# Altium schematic sheet miniPCIE_Connector.SchDoc: miniPCIE Connector
size B; DocumentNumber: 10; SheetNumber: 10; SheetTotal: 46
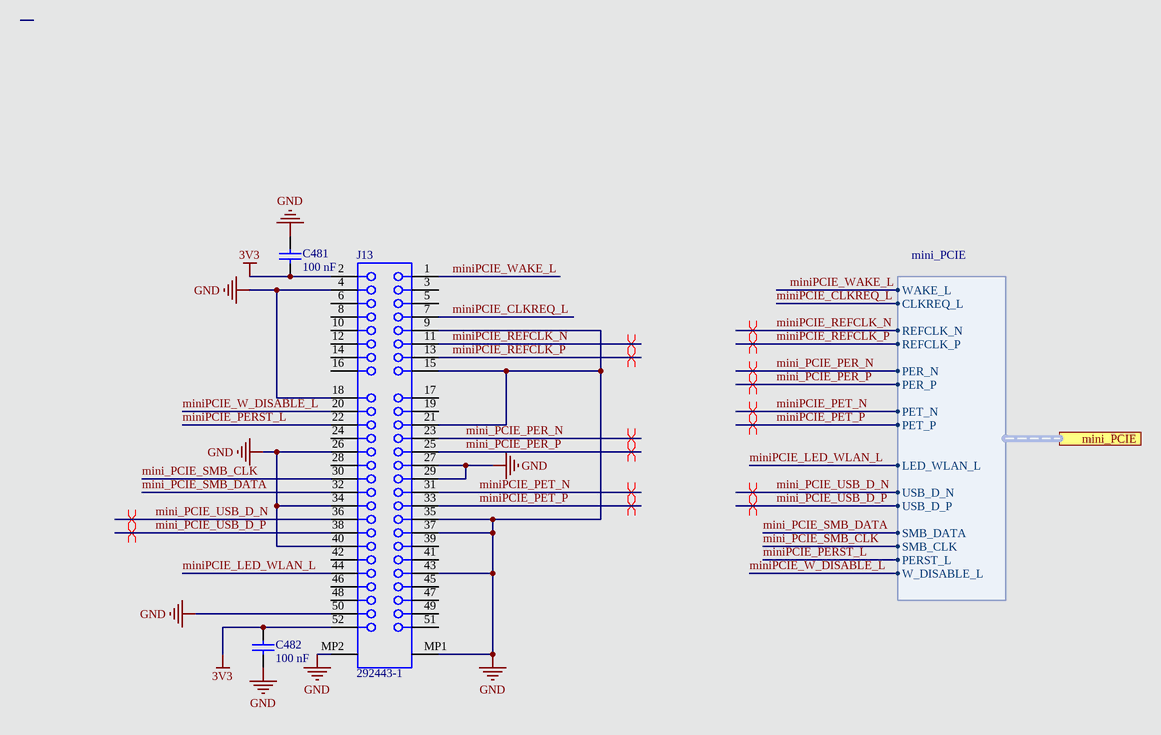
[diagram p0: miniPCIE_Connector.SchDoc]

## Parts
C481  Capacitance: 100 nF  [CAPC1005X55X10LL05]  (hidden comment: C1005X7R1E104M)
C482  Capacitance: 100 nF  [CAPC1005X55X10LL05]  (hidden comment: C1005X7R1E104M)
J13  292443-1  [BTB-SM0-8-2H52F]

## Ports
mini_PCIE (harness mini_PCIE)

## Harnesses
mini_PCIE: WAKE_L, CLKREQ_L, REFCLK_N, REFCLK_P, PER_N, PER_P, PET_N, PET_P, LED_WLAN_L, USB_D_N, USB_D_P, SMB_DATA, SMB_CLK, PERST_L, W_DISABLE_L

## Nets
3V3: C481.2 C482.1 J13.2 J13.52
GND: C481.1 C482.2 J13.4 J13.9 J13.15 J13.18 J13.21 J13.26 J13.27 J13.29 J13.34 J13.35 J13.37 J13.40 J13.43 J13.50 J13.MP1 J13.MP2
mini_PCIE_PER_N: J13.23 ; port mini_PCIE.PER_N
mini_PCIE_PER_P: J13.25 ; port mini_PCIE.PER_P
mini_PCIE_SMB_CLK: J13.30 ; port mini_PCIE.SMB_CLK
mini_PCIE_SMB_DATA: J13.32 ; port mini_PCIE.SMB_DATA
mini_PCIE_USB_D_N: J13.36 ; port mini_PCIE.USB_D_N
mini_PCIE_USB_D_P: J13.38 ; port mini_PCIE.USB_D_P
miniPCIE_CLKREQ_L: J13.7 ; port mini_PCIE.CLKREQ_L
miniPCIE_LED_WLAN_L: J13.44 ; port mini_PCIE.LED_WLAN_L
miniPCIE_PERST_L: J13.22 ; port mini_PCIE.PERST_L
miniPCIE_PET_N: J13.31 ; port mini_PCIE.PET_N
miniPCIE_PET_P: J13.33 ; port mini_PCIE.PET_P
miniPCIE_REFCLK_N: J13.11 ; port mini_PCIE.REFCLK_N
miniPCIE_REFCLK_P: J13.13 ; port mini_PCIE.REFCLK_P
miniPCIE_W_DISABLE_L: J13.20 ; port mini_PCIE.W_DISABLE_L
miniPCIE_WAKE_L: J13.1 ; port mini_PCIE.WAKE_L

Not connected (* = marked no-connect by the designer): J13 3 5 6 8 10 12 14 16 17 19 24 28 39 41 42 45 46 47 48 49 51

## Layout directives
differential pair: mini_PCIE_PER_N, mini_PCIE_PER_P, mini_PCIE_USB_D_N, mini_PCIE_USB_D_P, miniPCIE_PET_N, miniPCIE_PET_P, miniPCIE_REFCLK_N, miniPCIE_REFCLK_P

## Notes on the sheet
- Title
- Size:
- Date:
- B
- Number:
- Time:
- Revision:
- Sheet
- of
- File:

## Library data of the parts
C481 C482 = CMP-1663-00009-2: Chip Capacitor, 0.1 uF, +/- 20%, 25 V, -55 to 125 degC, 0402 (1005 Metric), RoHS, Tape and Reel; Type (Capacitors): X7R; Voltage Rating: 25 V; Case\/Package: 0402; Tolerance: 20%; Mounting Technology: Surface Mount; Max Operating Temperature: 125 degC; ComponentLink2URL: http://www.farnell.com/datasheets/1571323.pdf; ComponentLink1URL: http://www.tdk.com/; RoHSCompliant: true; Packaging: Tape and Reel; ComponentLink2Description: Datasheet; Case Code (Imperial): 0402; DatasheetVersion: 09/2011; ComponentLink1Description: Manufacturer URL; PackageDescription: 2-Pin Surface Mount Device, Body 1 x 0.5 mm; PackageReference: 0402; Min Operating Temperature: -55 degC; Case Code (Metric): 1005; Height: 0.5 mm; Package Quantity: 10000; Width: 0.5 mm; Pins: 2; Voltage Rating (DC): 25 V; PartNumber: C1005X7R1E104M; Mount: Surface Mount; Length: 1 mm
J13 = CMP-0001-00120-2: Board-to-Board Connector, SMT, Right Angle, Pitch 0.8mm, 52-Position, Female; Mating Connector: PCIeMini-CN-2S-M-R52; Publisher: Altium; Package Reference: BTB-SM0-8-2H52F; Datasheet Version: Oct-2006; ClassName: Board Template Connector; Component Kind: Standard; System: Connector